# Altium schematic sheet LoRa_SX1278.SchDoc
size A; SheetNumber: 3; SheetTotal: 3
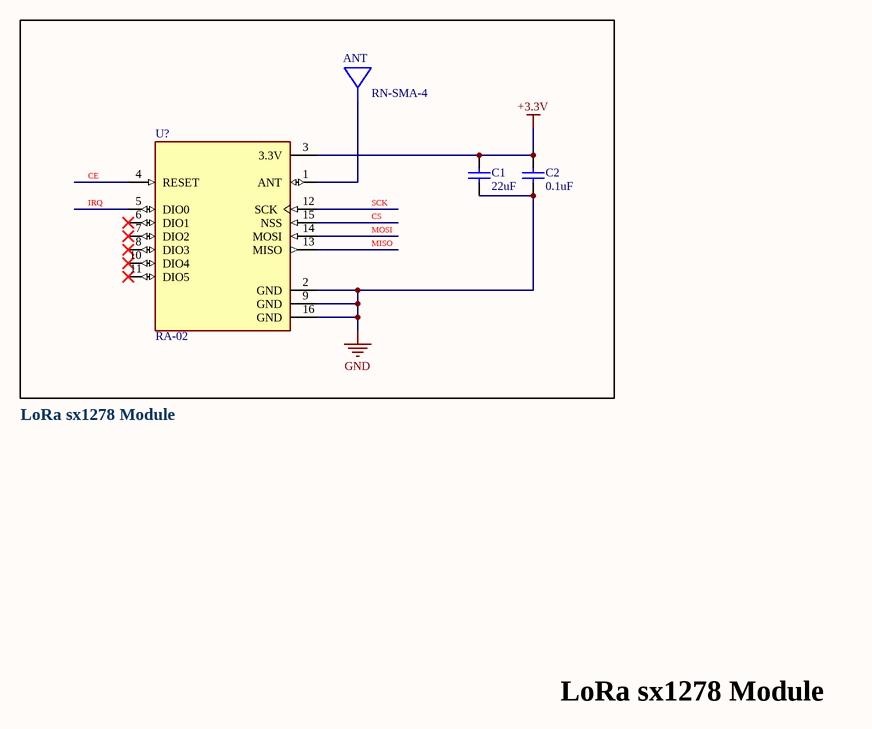
[diagram p0: LoRa_SX1278.SchDoc]

## Parts
ANT  RN-SMA-4  [FP-RN-SMA-4-MFG]
C1  value 22uF  (hidden comment: Capacitor)
C2  value 0.1uF  (hidden comment: Capacitor)
U?  RA-02  [XCVR_RA-01H]

## Nets
+3.3V: C1.2 C2.2 U?.3(3.3V)
GND: C1.1 C2.1 U?.2(GND) U?.9(GND) U?.16(GND)

Not connected (* = marked no-connect by the designer): U? 1(ANT) 4(RESET) 5(DIO0) 6(DIO1)* 7(DIO2)* 8(DIO3)* 10(DIO4)* 11(DIO5)* 12(SCK) 13(MISO) 14(MOSI) 15(NSS)

## Notes on the sheet
- CE
- IRQ
- SCK
- CS
- MOSI
- MISO
- LoRa sx1278 Module

## Library data of the parts
ANT = CMP-06329-000002-1: RF ANT 2.4GHZ WHIP SMA MALE 4"; Number of Bands: 1; Input Impedance: 50R; VSWR: 1.9; Bandwidth: 120MHz; Frequency: 2.45GHz; REACH SVHC: No SVHC; Height: 4.449inch; Packaging: Bulk; Case/Package: SMA; Package Quantity: 1; Lead Free: Lead Free; Series: -; Termination: SMA; Connector Type: SMA; Radiation Hardening: No; Impedance: 50R; Mount: Connector
C1 C2 = Capacitor: SimulationGenericComponent: True
U? = RA-01H: MÃ´-Ä‘un thu phÃ¡t LoRaâ„¢ ISM < 1GHz chung KhÃ´ng bao gá»“m Äƒng-ten 803 MHz ~ 930 MHz GiÃ¡ treo bá» máº·t; MF: AI-Thinker; SnapEDA_Link: https://www.snapeda.com/parts/RA-01H/AI-Thinker/view-part/?ref=snap; Package: Package; Value: *; MP: RA-01H; Check_prices: https://www.snapeda.com/parts/RA-01H/AI-Thinker/view-part/?ref=eda